# Altium schematic sheet PWR_PROT_AND_VI_SENSE.SchDoc
size A; SheetNumber: 17; SheetTotal: 23
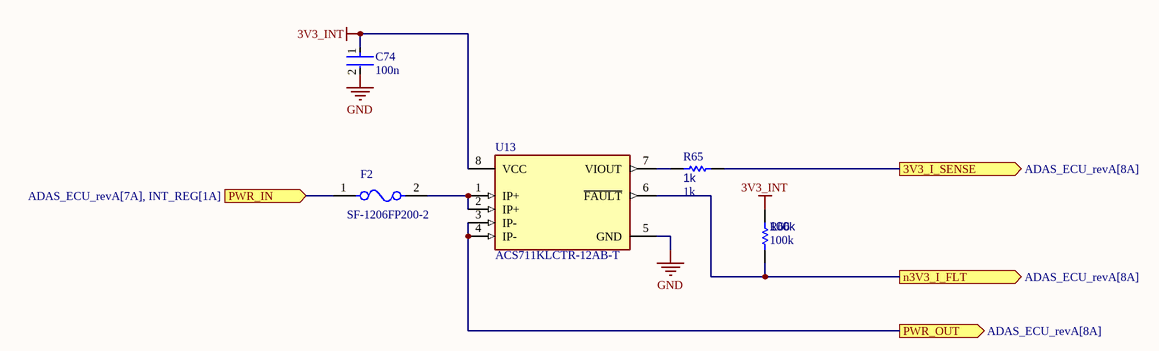
[diagram p0: PWR_PROT_AND_VI_SENSE.SchDoc]

## Parts
C74  100n  [FP-0402-L_1_0_0_05-W_0_5-IPC_A]
F2  SF-1206FP200-2  [FP-SF-1206FP-MFG]
R65  1k  [R0603B]
R66  100k  [R0603B]
U13  ACS711KLCTR-12AB-T  [FP-LC-8-IPC_C]

## Ports
3V3_I_SENSE (out, see ADAS_ECU_revA[8A]), n3V3_I_FLT (out, see ADAS_ECU_revA[8A]), PWR_IN (in, see ADAS_ECU_revA[7A], INT_REG[1A]), PWR_OUT (out, see ADAS_ECU_revA[8A])

## Nets
3V3_INT: C74.1 R66.2 U13.8(VCC)
GND: C74.2 U13.5(GND)
3V3_I_SENSE: R65.2 ; port 3V3_I_SENSE
n3V3_I_FLT: R66.1 U13.6(~{FAULT}) ; port n3V3_I_FLT
PWR_IN: F2.1 ; port PWR_IN
PWR_OUT: U13.3(IP-) U13.4(IP-) ; port PWR_OUT
NetF2_2: F2.2 U13.1(IP+) U13.2(IP+)
NetR65_1: R65.1 U13.7(VIOUT)

## Library data of the parts
C74 = CMP-001-00058-1: LARGE PADS, 0402 CAP, CHANGE COMMENT TO MATCH REAL P/N; Capacitor Type: Ceramic; Min Operating Temperature: -55°C; Mounting Technology: Surface Mount; Pins: 2; Case/Package: 0402; RoHS Compliant: Yes; Max Operating Temperature: 85°C
F2 = CMP-07399-000013-1: FUSE BOARD MOUNT 2A 63VDC 1206; Voltage Rating (DC): 63V; Fuse Type: Board Mount (Cartridge Style Excluded); Approvals: UL; Mount: Surface Mount; Min Operating Temperature: -20°C; Max Operating Temperature: 105°C; Case Code (Imperial): 1206; Packaging: Cut Tape; Current Rating: 2A; RoHS Compliant: Yes; Series: SinglFuse™ SF-1206FP; Case Code (Metric): 3216; Case/Package: 1206
R65 R66 = CMP-009-00002-14: Resistor
  R65: Value: 1k
  R66: Value: 100k
U13 = CMP-1557-00012-2: SENSOR CURRENT HALL 12.5A AC/DC; Number of Channels: 1; Min Supply Voltage: 3V; Sensitivity: 110mV/A; Response Time: 4.6us; Operating Supply Voltage: 3.3V; Max Supply Voltage: 5.5V; Max Supply Current: 5.5mA; Bandwidth: 100kHz; Linearity: 1%; Quiescent Current: 4mA; Accuracy: 5%; Polarity: Bidirectional; Case/Package: SOIC; Packaging: Tape and Reel; Number of Pins: 8; Width: 3.9mm; Frequency: 100kHz; -3db Bandwidth: 100kHz; REACH SVHC: No SVHC; Series: -; Height: 1.5mm; Package Quantity: 1; Min Operating Temperature: -40°C; Max Operating Temperature: 125°C; Current Sensing: 12.5A; RoHS Compliant: Yes; Length: 4.9mm